# EAGLE design probatio-pcb-block-4pads (EAGLE 9.6.2)
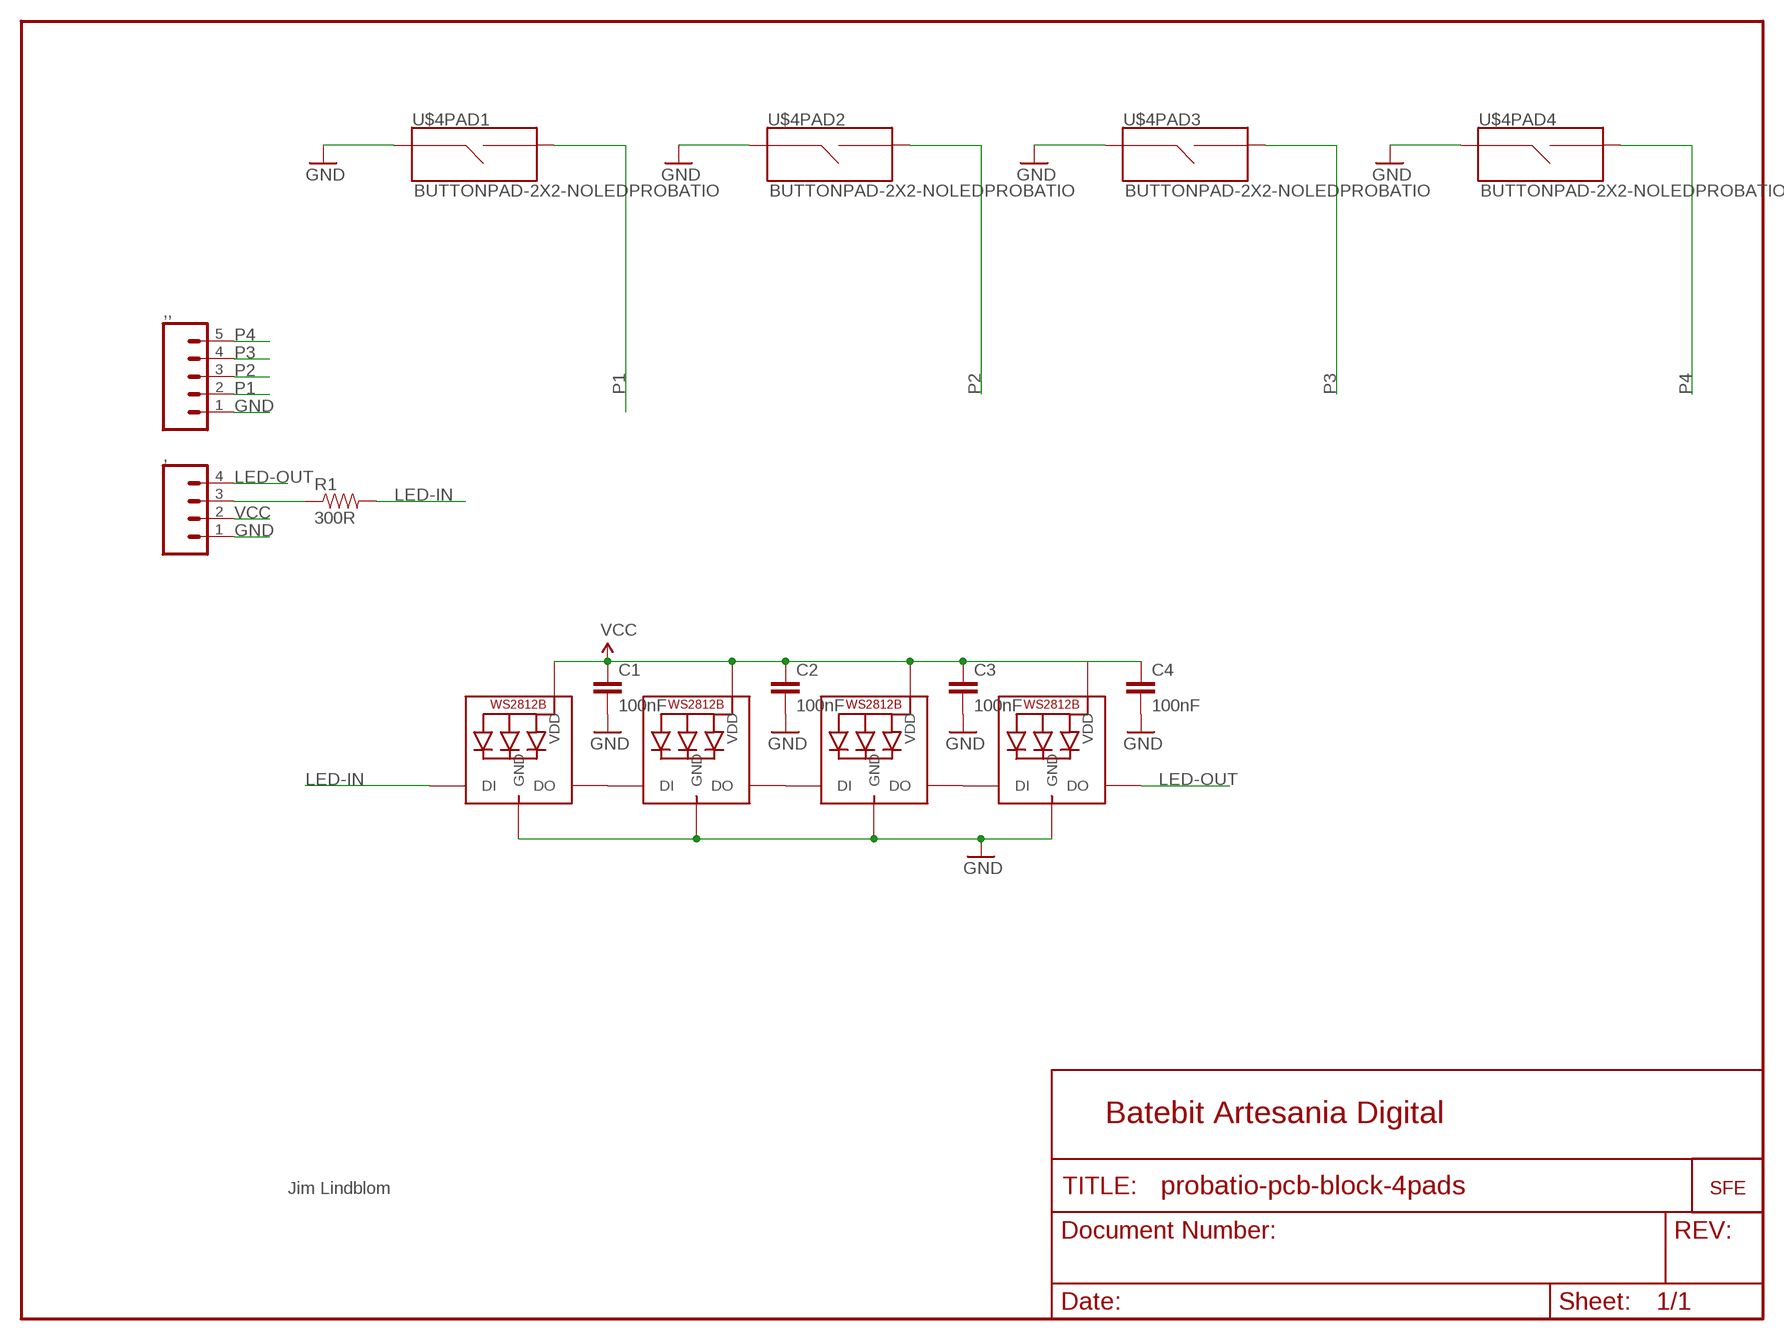
[diagram p0: schematic, sheet 1]

## Parts
,  CONN_04PTH  [1X04]
,,  M05PTH  [1X05]
C1  100nF  CAP0805-CAP  [0805-CAP]
C2  100nF  CAP0805-CAP  [0805-CAP]
C3  100nF  CAP0805-CAP  [0805-CAP]
C4  100nF  CAP0805-CAP  [0805-CAP]
LED1  WS2812B3535  [LED3535]
LED2  WS2812B3535  [LED3535]
LED3  WS2812B3535  [LED3535]
LED4  WS2812B3535  [LED3535]
R1  300R  RESISTORPTH-1/4W  [AXIAL-0.4]
U$1  LOGO-SFENEW  [SFE-NEW-WEBLOGO]
U$4  BUTTONPAD-2X2-NOLEDPROBATIO  [BUTTONPAD-2X2-PROBATIO-NOLED]

## Nets
GND: ,,.1 ,.1 C1.2 C2.2 C3.2 C4.2 LED1.4(GND) LED2.4(GND) LED3.4(GND) LED4.4(GND) U$4.SIG1(PAD1:SIG1) U$4.SIG3(PAD2:SIG1) U$4.SIG5(PAD3:SIG1) U$4.SIG7(PAD4:SIG1)
L: ,.3 R1.P$1
LED-IN: LED1.1(DI) R1.P$2
LED-OUT: ,.4 LED4.3(DO)
N$5: LED1.3(DO) LED2.1(DI)
N$6: LED2.3(DO) LED3.1(DI)
N$7: LED3.3(DO) LED4.1(DI)
P1 [ButtonSignal]: ,,.2 U$4.SIG2(PAD1:SIG2)
P2 [ButtonSignal]: ,,.3 U$4.SIG4(PAD2:SIG2)
P3 [ButtonSignal]: ,,.4 U$4.SIG6(PAD3:SIG2)
P4 [ButtonSignal]: ,,.5 U$4.SIG8(PAD4:SIG2)
VCC [ButtonSignal]: ,.2 C1.1 C2.1 C3.1 C4.1 LED1.2(VDD) LED2.2(VDD) LED3.2(VDD) LED4.2(VDD)

## Notes on the sheet
- Batebit Artesania Digital
- Jim Lindblom

## Library data of the parts
, = Batebit:CONN_04: Multi connection point. Often used as Generic Header-pin footprint for 0.1 inch spaced/style header connections On any of the 0.1 inch spaced packages, you can populate with these: Break Away Headers - Straight <https://www.sparkfun.com/products/116> (PRT-00116) Break Away Male Headers - Right Angle <https://www.sparkfun.com/products/553> (PRT-00553) Female Headers <https://www.sparkfun.com/products/115> (PRT-00115) Break Away Headers - Machine Pin <https://www.sparkfun.com/products/117> (PRT-00117) Break Away Female Headers - Swiss Machine Pin <https://www.sparkfun.com/products/743> (PRT-00743) For SCREWTERMINALS and SPRING TERMINALS visit here: Screw Terimnals on SparkFun.com <https://www.sparkfun.com/search/results?term=Screw+Terminals> (5mm/3.5mm/2.54mm spacing) This device is also useful as a general connection point to wire up your design to another part of your project. Our various solder wires solder well into these plated through hole pads. Hook-Up Wire - Assortment (Stranded, 22 AWG) <https://www.sparkfun.com/products/11375> (PRT-11375) Hook-Up Wire - Assortment (Solid Core, 22 AWG) <https://www.sparkfun.com/products/11367> (PRT-11367) View the entire wire category on our website here <https://www.sparkfun.com/categories/141> Special notes: Molex polarized connector foot print use with SKU : PRT-08231 with associated crimp pins and housings. 1MM SMD Version SKU: PRT-10208; PROD_ID: CONN-09696
,, = Batebit:M05: Header 5 Standard 5-pin 0.1" header. Use with straight break away headers (SKU : PRT-00116), right angle break away headers (PRT-00553), swiss pins (PRT-00743), machine pins (PRT-00117), and female headers (PRT-00115). Molex polarized connector foot print use with SKU : PRT-08230 with associated crimp pins and housings.
C1-C4 = Batebit:CAP: Capacitor Standard 0603 ceramic capacitor, and 0.1" leaded capacitor.
LED1-LED4 = Batebit:WS2812B
R1 = Batebit:RESISTOR: Resistor Basic schematic elements and footprints for 0603, 1206, and PTH resistors.
U$1 = SparkFun:LOGO-SFE: Spark Fun Electronics PCB Logo This is the standard Spark Fun Electronics PCB logo.
U$4 = Batebit:BUTTONPAD-2X2-NOLED

## Net classes
0 Default: width 0.305 mm, drill 0.508 mm, clearance 0.305 mm
1 Power: width 0.305 mm, drill 0.508 mm, clearance 0.305 mm
2 LEDPower: width 0.305 mm, drill 0.508 mm, clearance 0.305 mm
3 ButtonSignal: width 0.305 mm, drill 0.508 mm, clearance 0.305 mm

## Board
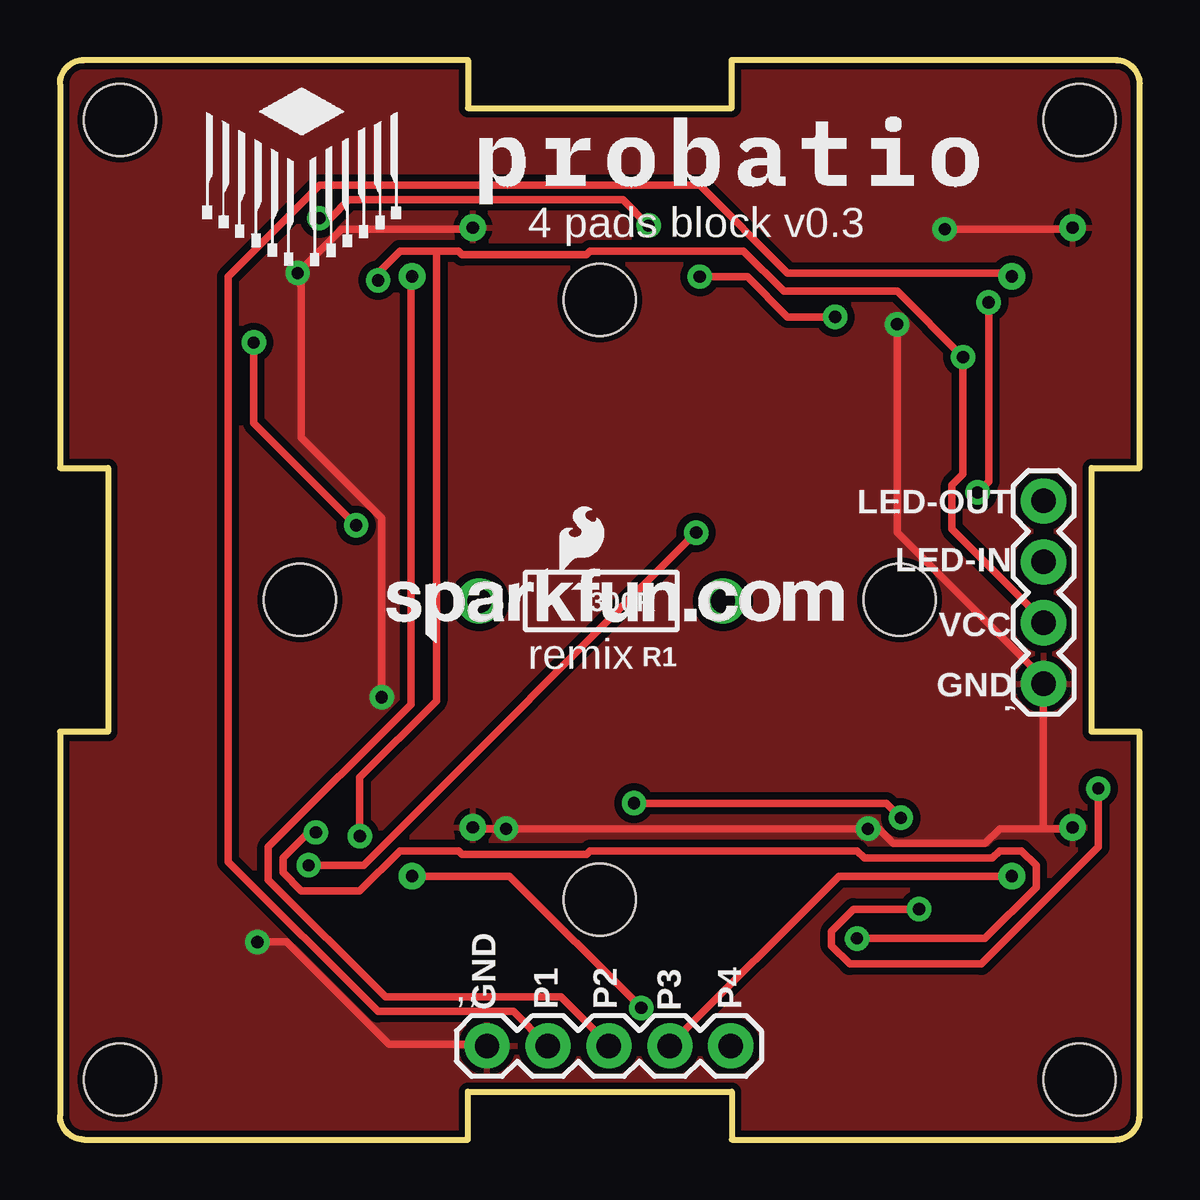
[diagram p1: board, top side]
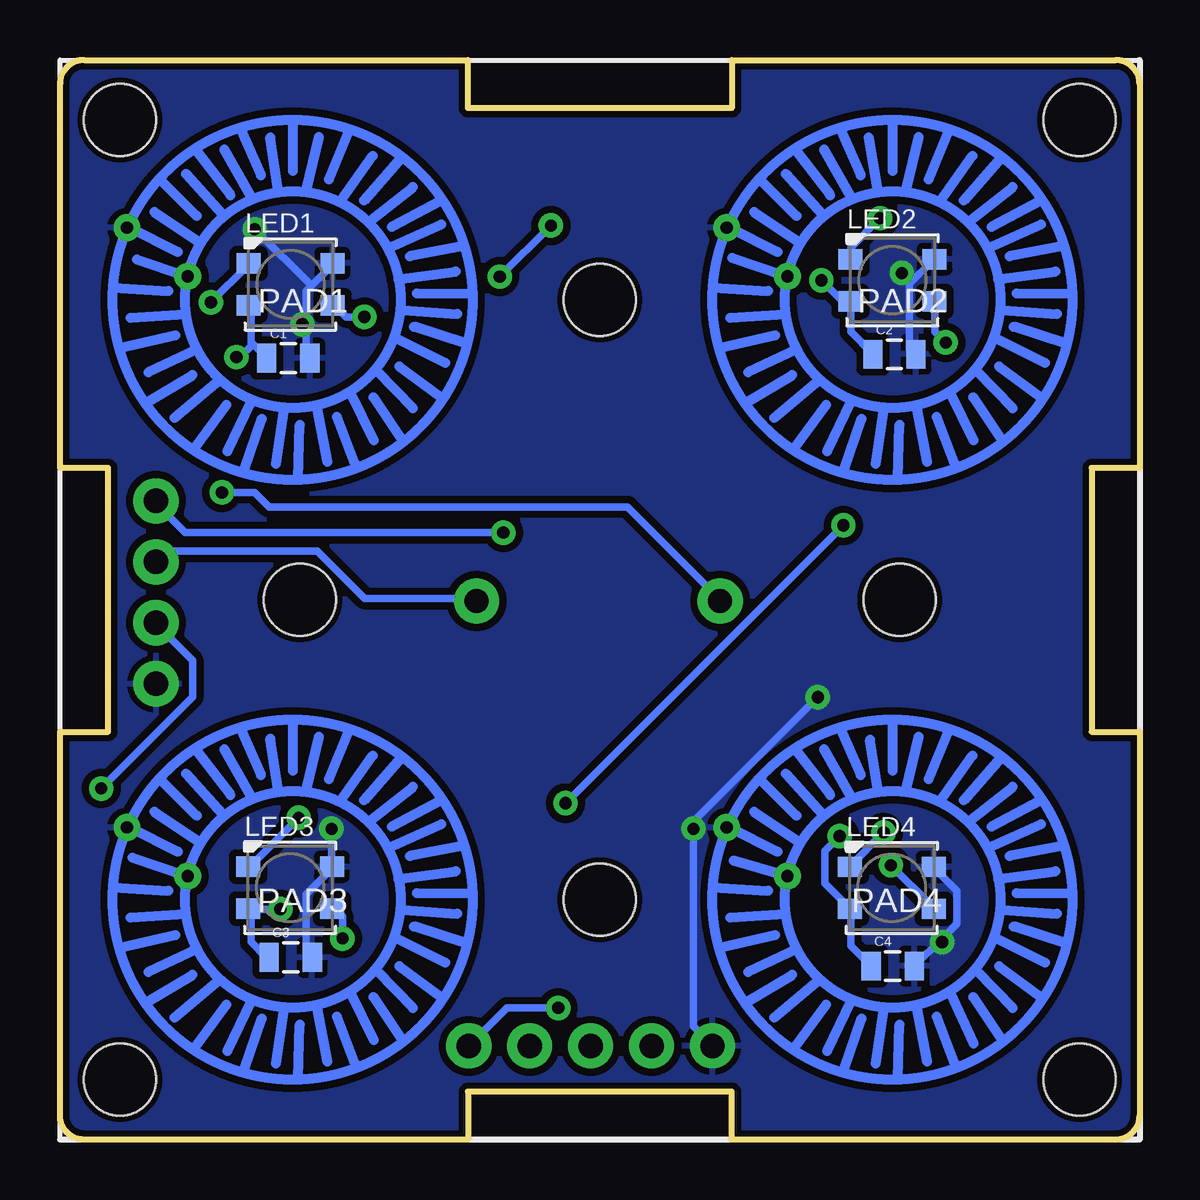
[diagram p2: board, bottom side, seen from below]

Size 45 x 45 mm. Coordinates in mm from the lower left corner, seen from the top.
Outline: 1,0 17,0 17,2 28,2 28,0 44,0 arc90 45,1 45,17 43,17 43,28 45,28 45,44 arc90 44,45 28,45 28,43 17,43 17,45 1,45 arc90 0,44 0,28 2,28 2,17 0,17 0,1 arc90 1,0
Copper layers (1*16): Top 0.035mm / dielectric 1.5mm / Bottom 0.035mm
Design rules "SparkFun": minimum track width 8mil, minimum drill 20mil, track to track 8mil, track to pad 8mil, pad to pad 8mil, via to via 8mil, smd to smd 8mil, copper to edge 10mil, drill to drill 8mil, minimum pad ring 12mil, minimum via ring 10mil, stop-mask expansion 4mil, vias tented up to drill 25mil, thermal gap 10mil

### Footprints (pad centres in the part's own frame; a part is rotated, then mirrored left to right if it is on the bottom)
1X04 = drill 1.016 pad 1.88: 1 0,0; 2 2.54,0; 3 5.08,0; 4 7.62,0
1X05 = drill 1.016 pad 1.88: 1 0,0; 2 2.54,0; 3 5.08,0; 4 7.62,0; 5 10.16,0
0805-CAP = smd 0.8 x 1.2: 1 -0.9,0; 2 0.9,0
LED3535 = smd 1 x 0.85: 1 -1.75,0.875; 2 -1.75,-0.875; 3 1.75,-0.875; 4 1.75,0.875
AXIAL-0.4 = drill 1 pad 1.88: P$1 -5.08,0; P$2 5.08,0
BUTTONPAD-2X2-PROBATIO-NOLED = drill 0.508: SIG1 2.788,38.013; SIG2 5.328,35.981; SIG3 27.788,38.013; SIG4 30.328,35.981; SIG5 2.788,13.013; SIG6 5.328,10.981; SIG7 27.788,13.013; SIG8 30.328,10.981 | hole 3: 10,22.5; 22.5,35; 35,22.5; 22.5,10; 2.5,2.5; 2.5,42.5; 42.5,42.5; 42.5,2.5

### Placement (x,y rotation side)
,  41,19 90 top
,,  17.8,3.9 0 top
C1  35.48,32.57 0 bottom
C2  10.22,32.73 0 bottom
C3  35.38,7.6 0 bottom
C4  10.29,7.23 0 bottom
LED1  35.39,35.65 0 bottom
LED2  10.3,35.82 0 bottom
LED3  35.41,10.5 0 bottom
LED4  10.33,10.49 0 bottom
R1  22.56,22.45 180 top
U$1  13.61,20.68 0 top
U$3  [PROBATIO]  22,40 0 top
U$4  45,0 0 bottom

### Tracks (layer width: path | path; a pad name or v marks a point on that pad's centre or on a via)
GND  (via drill 0.51)
  Top 0.305: U$4.SIG3 17.07,37.95 11.73,37.95 v9.91,36.12 10.06,36.12 10.06,29.26 13.41,25.91 v13.41,18.44 | v8.23,8.23 9.45,8.23 13.72,3.96 17.68,3.96 ,,.1 | v36.88,37.95 42.06,37.95 U$4.SIG1 | 41,12.95 42.06,12.95 U$4.SIG5 | 41,12.95 39.17,12.95 38.56,12.34 34.75,12.34 34.14,12.95 v33.68,12.95 v18.59,12.95 17.22,12.95 U$4.SIG7 | 41,12.95 41,18.9 ,.1 41.15,19.05 34.9,25.3 v34.9,33.98
  Bottom 0.305: 9.53,35.74 9.6,35.66 9.6,32.92 9.45,32.77 C2.2 | 9.53,35.74 8.69,36.58 LED2.4 | 9.53,35.74 v9.91,36.12 | 8.31,8.31 9.3,7.32 C4.2 | 8.31,8.31 7.62,8.99 7.62,10.36 8.53,11.28 LED4.4 | v8.23,8.23 8.31,8.31 | v13.41,18.44 18.59,13.26 v18.59,12.95 18.59,4.72 17.83,3.96 ,,.1 | 34.52,35.59 34.75,35.36 34.75,33.98 | 34.52,35.59 33.68,36.42 LED1.4 | 34.75,33.98 34.75,32.77 34.59,32.61 C1.2 | 34.52,35.59 v36.88,37.95 | C3.2 34.59,7.62 34.75,7.77 34.75,10.21 33.68,11.28 LED3.4 33.68,11.43 v33.68,12.95 | v34.9,33.98 34.75,33.98
  pour Top (isolate 0.254): 0,0 45,0 45,45 0,45
  pour Bottom (isolate 0.254): 0,0 45,0 45,45 0,45
L
  Bottom 0.305: R1.P$1 27.74,22.55 32.31,22.55 34.29,24.54 40.69,24.54 41,24.23 ,.3
LED-IN  (via drill 0.51)
  Top 0.305: v38.71,34.9 38.71,27.43 v38.25,26.98
  Bottom 0.305: v38.71,34.9 37.19,36.42 LED1.1 | v38.25,26.98 36.88,26.98 36.27,26.36 21.34,26.36 17.53,22.55 R1.P$2
LED-OUT  (via drill 0.51)
  Top 0.305: v10.36,11.43 12.65,11.43 v26.52,25.3
  Bottom 0.305: v10.36,11.43 8.69,9.75 LED4.3 | v26.52,25.3 39.78,25.3 41,26.52 ,.4
N$5  (via drill 0.51)
  Top 0.305: v10.82,38.41 11.28,38.41 12.04,39.17 23.47,39.17 v24.54,38.1 | v26.67,35.97 28.65,35.97 30.33,34.29 v32.31,34.29
  Bottom 0.305: v10.82,38.41 12.04,37.19 12.04,36.73 LED2.1 | v26.67,35.97 v24.54,38.1 | v32.31,34.29 33.07,34.29 33.53,34.75 LED1.3
N$6  (via drill 0.51)
  Top 0.305: v8.08,33.22 8.08,29.87 v12.34,25.6 | v23.93,14.02 34.44,14.02 v35.05,13.41
  Bottom 0.305: v8.08,33.22 8.53,33.68 8.53,34.9 LED2.3 | v23.93,14.02 v12.34,25.6 | v35.05,13.41 37.03,11.43 LED3.1
N$7  (via drill 0.51)
  Top 0.305: v10.67,12.8 10.36,12.8 9.3,11.73 9.3,11.12 10.06,10.36 12.5,10.36 14.17,12.04 16.61,12.04 16.76,11.89 21.95,11.89 22.1,12.04 33.22,12.04 33.53,11.73 38.86,11.73 39.17,12.04 40.08,12.04 40.69,11.43 40.69,10.52 38.56,8.38 v33.22,8.38
  Bottom 0.305: v10.67,12.8 12.04,11.43 LED4.1 | v33.22,8.38 33.22,9.3 33.53,9.6 LED3.3
P1
  Top 0.305: U$4.SIG2 39.62,36.12 30.33,36.12 26.67,39.78 10.82,39.78 7.01,35.97 7.01,11.58 13.26,5.33 18.9,5.33 20.27,3.96 ,,.2
P2
  Top 0.305: U$4.SIG4 14.63,35.97 14.63,18.14 8.69,12.19 8.69,10.82 13.56,5.94 20.88,5.94 22.86,3.96 ,,.3
P3
  Top 0.305: U$4.SIG6 39.62,10.97 32.46,10.97 25.45,3.96 ,,.4
P4  (via drill 0.51)
  Top 0.305: v24.23,5.49 18.75,10.97 14.78,10.97 U$4.SIG8
  Bottom 0.305: v24.23,5.49 26.36,5.49 27.89,3.96 ,,.5
VCC  (via drill 0.51)
  Top 0.305: v35.81,9.6 33.07,9.6 32.16,8.69 32.16,8.08 32.92,7.32 38.41,7.32 43.28,12.19 v43.28,14.63 | ,.2 41,21.64 37.19,25.45 37.19,27.28 37.64,27.74 v37.64,32.61 34.9,35.36 30.18,35.36 28.5,37.03 22.1,37.03 21.95,36.88 16.76,36.88 16.61,37.03 15.7,37.03 | v13.26,35.81 13.26,36.12 14.17,37.03 15.7,37.03 | v12.5,12.65 12.5,15.09 15.7,18.29 15.7,37.03
  Bottom 0.305: C4.1 11.28,7.32 12.04,8.08 12.04,9.6 LED4.2 12.19,9.75 13.11,10.67 13.11,12.04 v12.5,12.65 | C2.1 11.12,32.77 12.04,33.68 12.04,34.9 LED2.2 12.19,35.05 12.5,35.05 v13.26,35.81 | C1.1 36.96,33.15 | 36.96,33.15 37.03,33.22 37.03,34.75 LED1.2 | C3.1 36.42,7.62 37.03,8.23 37.03,9.6 LED3.2 36.88,9.6 v35.81,9.6 | v43.28,14.63 39.47,18.44 39.47,19.96 41,21.49 ,.2 | 36.96,33.15 37.49,32.61 v37.64,32.61

### Text on the board
tPlace: 4 pads block v0.3 | LED-OUT | LED-IN | VCC | remix | GND | GND | P1 | P2 | P3 | P4
tValues: 300R
Document: J. Tragtenberg | N. Seidle